# EAGLE design PandN (EAGLE 5.10)
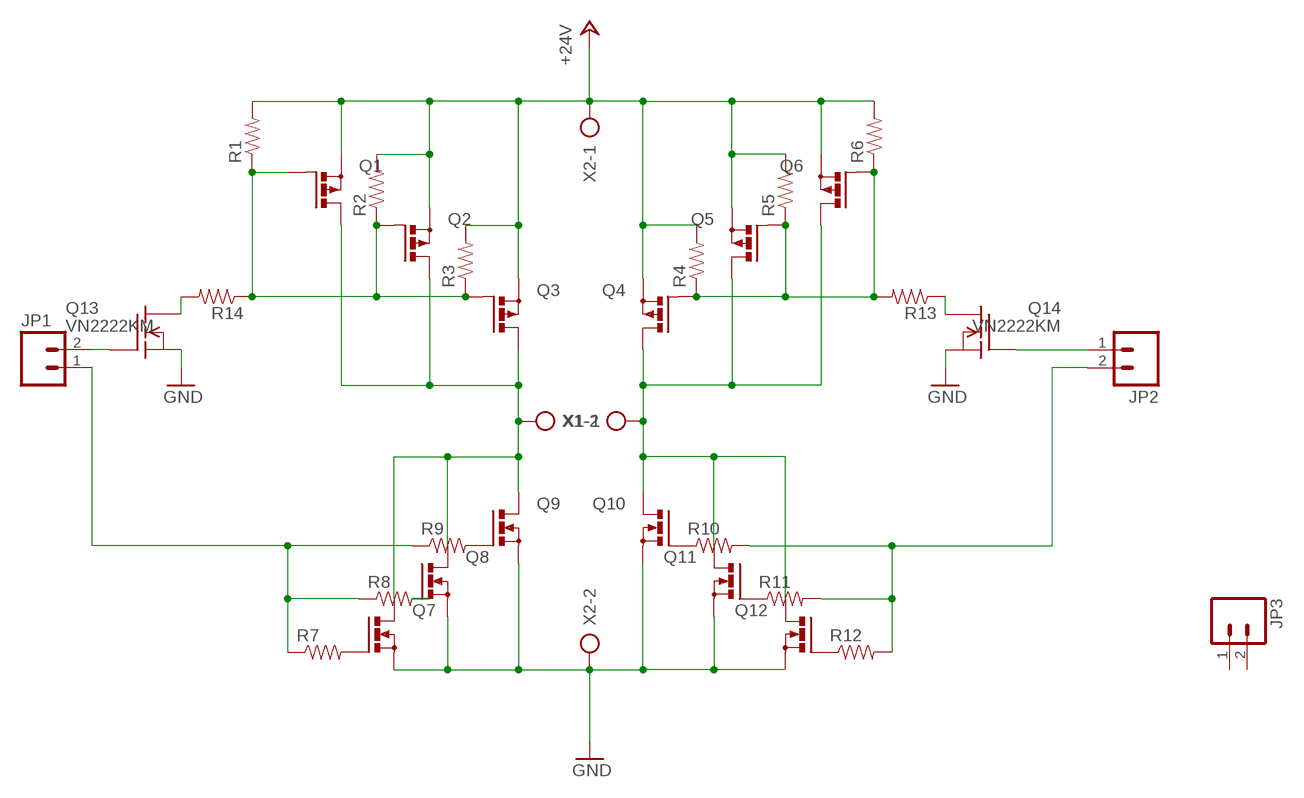
[diagram p0: schematic, sheet 1]

## Parts
JP1  M02PTH  [1X02]
JP2  M02PTH  [1X02]
JP3  M02PTH  [1X02]
Q1  PMOSFET_PTO220BV  [TO220BV]
Q2  PMOSFET_PTO220BV  [TO220BV]
Q3  PMOSFET_PTO220BV  [TO220BV]
Q4  PMOSFET_PTO220BV  [TO220BV]
Q5  PMOSFET_PTO220BV  [TO220BV]
Q6  PMOSFET_PTO220BV  [TO220BV]
Q7  PMOSFET_NTO220BV  [TO220BV]
Q8  PMOSFET_NTO220BV  [TO220BV]
Q9  PMOSFET_NTO220BV  [TO220BV]
Q10  PMOSFET_NTO220BV  [TO220BV]
Q11  PMOSFET_NTO220BV  [TO220BV]
Q12  PMOSFET_NTO220BV  [TO220BV]
Q13  VN2222KM  [TO237]
Q14  VN2222KM  [TO237]
R1  RESISTORPTH-1/6W  [1/6W-RES]
R2  RESISTORPTH-1/6W  [1/6W-RES]
R3  RESISTORPTH-1/6W  [1/6W-RES]
R4  RESISTORPTH-1/6W  [1/6W-RES]
R5  RESISTORPTH-1/6W  [1/6W-RES]
R6  RESISTORPTH-1/6W  [1/6W-RES]
R7  RESISTORPTH-1/6W  [1/6W-RES]
R8  RESISTORPTH-1/6W  [1/6W-RES]
R9  RESISTORPTH-1/6W  [1/6W-RES]
R10  RESISTORPTH-1/6W  [1/6W-RES]
R11  RESISTORPTH-1/6W  [1/6W-RES]
R12  RESISTORPTH-1/6W  [1/6W-RES]
R13  RESISTORPTH-1/6W  [1/6W-RES]
R14  RESISTORPTH-1/6W  [1/6W-RES]
X1  AK500/2  [AK500/2]
X2  AK500/2  [AK500/2]

## Nets
+24V: Q1.S Q2.S Q3.S Q4.S Q5.S Q6.S R1.2 R2.2 R3.2 R4.2 R5.2 R6.2 X2.1
GND: Q7.S Q8.S Q9.S Q10.S Q11.S Q12.S Q13.3(S) Q14.3(S) X2.2
N$1: Q1.D Q2.D Q3.D Q7.D Q8.D Q9.D X1.1
N$2: Q4.D Q5.D Q6.D Q10.D Q11.D Q12.D X1.2
N$3: Q4.G Q5.G Q6.G R4.1 R5.1 R6.1 R13.2
N$4: JP1.2 Q13.2(G)
N$5: JP2.1 Q14.2(G)
N$6: Q1.G Q2.G Q3.G R1.1 R2.1 R3.1 R14.1
N$7: Q11.G R11.1
N$8: Q10.G R10.1
N$9: Q12.G R12.1
N$10: Q7.G R7.2
N$11: Q8.G R8.2
N$12: Q9.G R9.2
N$13: Q13.1(D) R14.2
N$14: Q14.1(D) R13.1
N$22: JP1.1 R7.1 R8.1 R9.1
N$23: JP2.2 R10.2 R11.2 R12.2
Unconnected: JP3.1 JP3.2

## Library data of the parts
JP1-JP3 = SparkFun:M02: Header 2 Standard 2-pin 0.1" header. Use with straight break away headers (SKU : PRT-00116), right angle break away headers (PRT-00553), swiss pins (PRT-00743), machine pins (PRT-00117), and female headers (PRT-00115). Molex polarized connector foot print use with SKU : PRT-08233 with associated crimp pins and housings.
Q1-Q6 = transistor-power:PMOSFET_P: Power MOSFET P-Channel
Q7-Q12 = transistor-power:PMOSFET_N: Power MOSFET N-Channel
Q13 Q14 = transistor-fet:VN2222KM: N-Channel Enhancement MOSFET (VMOS); 60V; 0,5A; 7,5Ohm
R1-R14 = SparkFun:RESISTOR: Resistor Basic schematic elements and footprints for 0603, 1206, and PTH 1/10th watt (small) resistors.
X1 X2 = con-ptr500:AK500/2: CONNECTOR

## Board
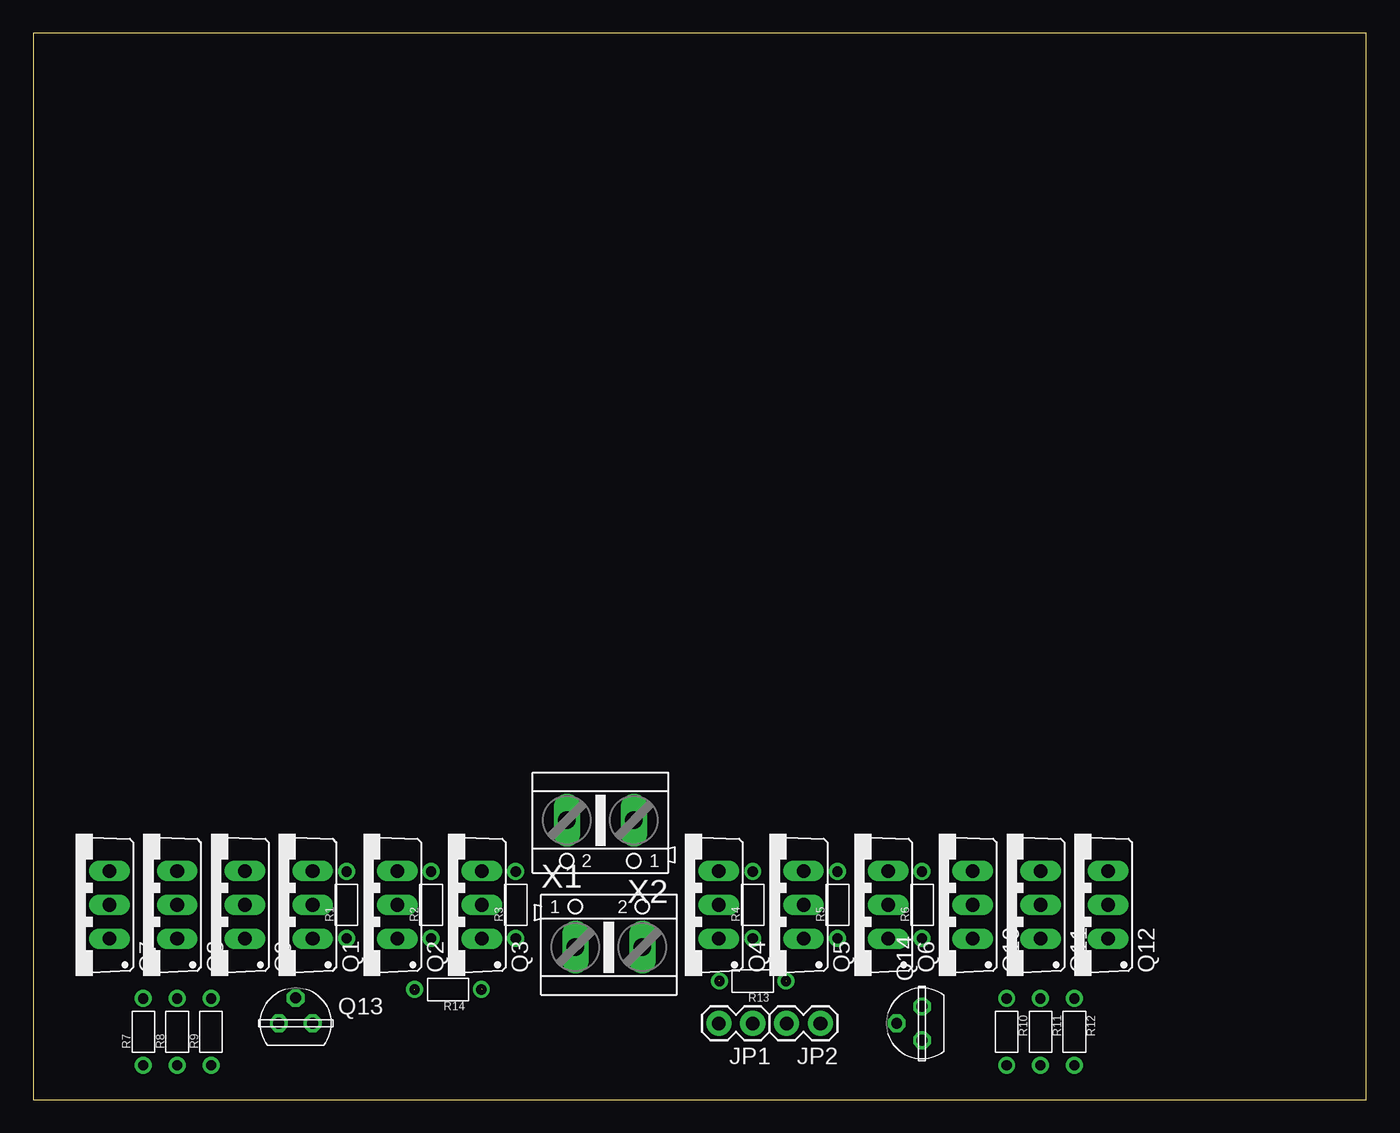
[diagram p1: board, top side]
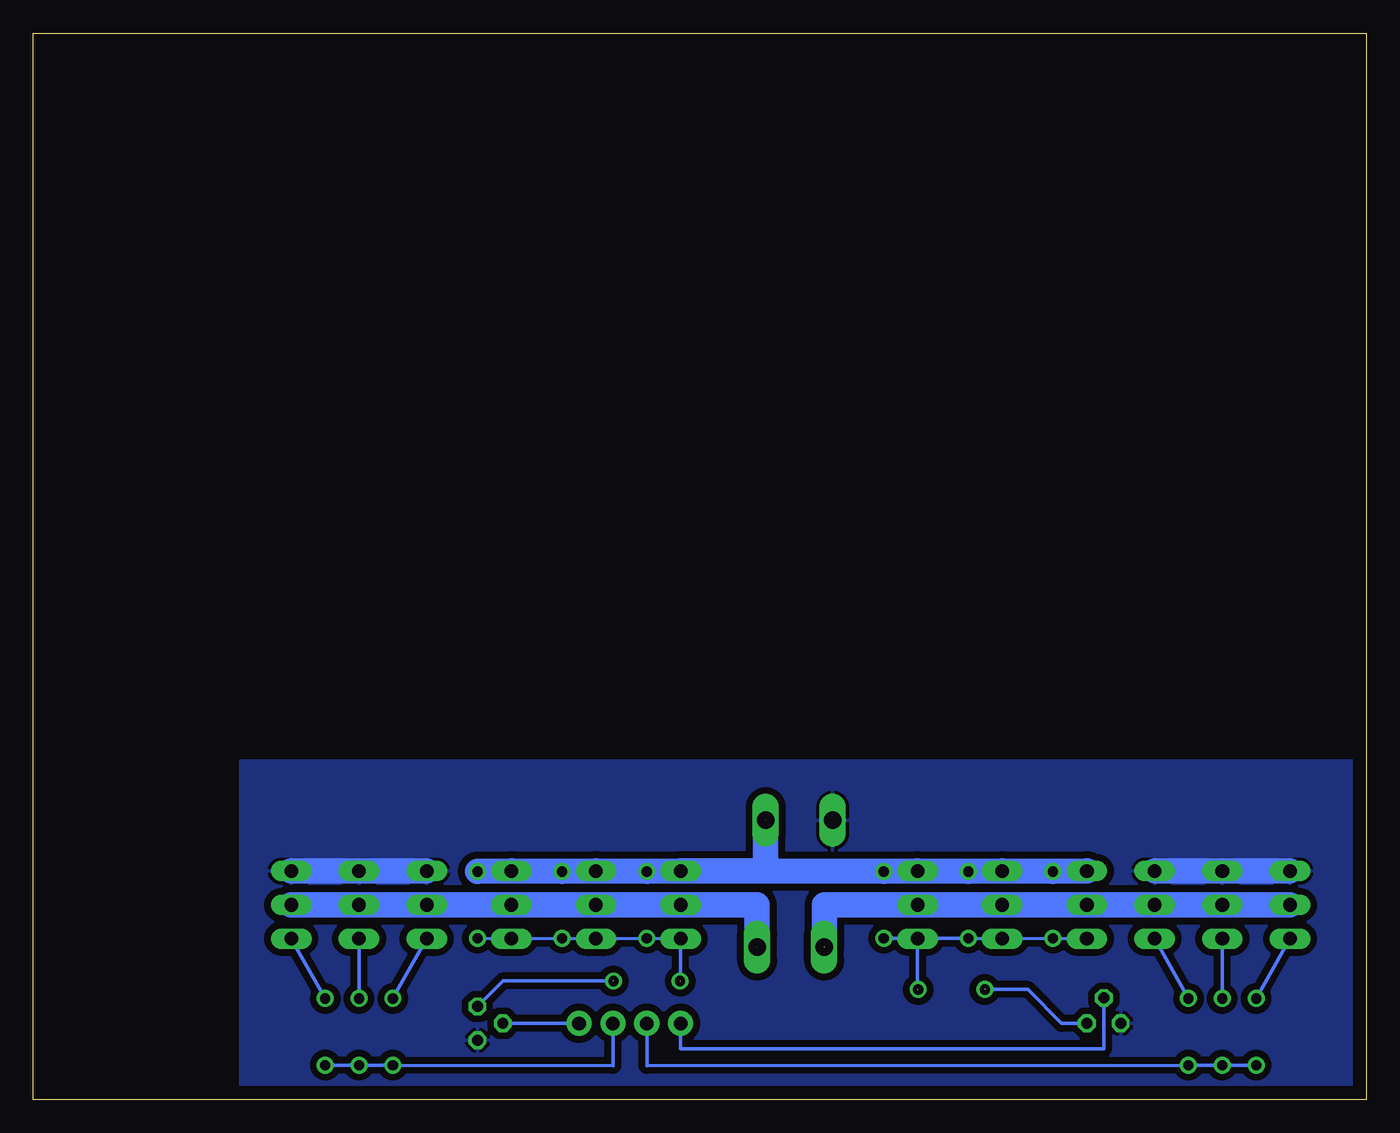
[diagram p2: board, bottom side, seen from below]

Size 100 x 80 mm. Coordinates in mm from the lower left corner, seen from the top.
Outline: 0,0 100,0 100,80 0,80 0,0
Copper layers (1*16): Top 0.035mm / dielectric 1.5mm / Bottom 0.035mm
Design rules "default *": minimum track width 10mil, minimum drill 24mil, track to track 20mil, track to pad 20mil, pad to pad 8mil, via to via 8mil, smd to smd 8mil, copper to edge 40mil, drill to drill 8mil, minimum pad ring 10mil, minimum via ring 8mil, stop-mask expansion 4mil, vias tented up to drill 0mil, thermal gap 10mil

### Footprints (pad centres in the part's own frame; a part is rotated, then mirrored left to right if it is on the bottom)
1X02 = drill 1.016 pad 1.88 round: 1 0,0; 2 2.54,0
TO220BV = drill 1.016 long: D 0,-2.54; G -2.54,-2.54; S 2.54,-2.54
TO237 = drill 0.813 octagon: 1 1.27,0; 2 0,1.905; 3 -1.27,0
1/6W-RES = drill 0.762 round: 1 -2.5,0; 2 2.5,0
AK500/2 = drill 1.321 long: 1 -2.515,0; 2 2.515,0

### Placement (x,y rotation side)
JP1  53.98,5.71 180 top
JP2  59.05,5.71 180 top
JP3  2.54,-16.51 0 top  (outside the outline)
Q1  18.41,14.61 90 top
Q2  24.77,14.61 90 top
Q3  31.11,14.61 90 top
Q4  48.9,14.61 90 top
Q5  55.24,14.61 90 top
Q6  61.59,14.61 90 top
Q7  3.17,14.61 90 top
Q8  8.26,14.61 90 top
Q9  13.34,14.61 90 top
Q10  67.94,14.61 90 top
Q11  73.03,14.61 90 top
Q12  78.11,14.61 90 top
Q13  19.68,5.71 0 top
Q14  66.67,5.71 90 top
R1  23.5,14.61 90 top
R2  29.84,14.61 90 top
R3  36.2,14.61 90 top
R4  53.98,14.61 90 top
R5  60.33,14.61 90 top
R6  66.67,14.61 90 top
R7  8.26,5.08 90 top
R8  10.79,5.08 90 top
R9  13.34,5.08 90 top
R10  73.03,5.08 270 top
R11  75.56,5.08 270 top
R12  78.11,5.08 270 top
R13  53.98,8.89 180 top
R14  31.11,8.26 180 top
X1  43.18,11.43 0 top
X2  42.55,20.95 180 top

### Tracks (layer width: path | path; a pad name or v marks a point on that pad's centre or on a via)
+24V  (1 unrouted)
  Bottom 1.93: Q1.S R1.2 Q2.S R2.2 Q3.S R3.2 45.09,17.14 | R6.2 Q6.S R5.2 Q5.S R4.2 Q4.S 45.09,17.14 | 45.09,17.14 45.09,20.95
GND
  Bottom 1.93: Q7.S Q8.S Q9.S | Q12.S Q11.S Q10.S
  pour Bottom: 0.64,25.4 0.64,0.64 84.45,0.64 84.45,25.4
N$1  (1 unrouted)
  Bottom 1.93: Q7.D Q8.D Q9.D Q1.D Q2.D Q3.D 40.64,14.61 40.64,11.43
N$2  (1 unrouted)
  Bottom 1.93: Q12.D Q11.D Q10.D Q6.D Q5.D Q4.D 45.72,14.61 45.72,11.43
N$3  (1 unrouted)
  Bottom 0.254: R6.1 Q6.G R5.1 Q5.G R4.1 Q4.G 51.44,8.89
N$4
  Bottom 0.254: JP1.2 51.44,3.81 19.68,3.81 Q13.2
N$5
  Bottom 0.254: JP2.1 Q14.2
N$6  (1 unrouted)
  Bottom 0.254: Q1.G R1.1 Q2.G R2.1 R3.1 Q3.G 33.66,8.26
N$7
  Bottom 0.254: R11.1 Q11.G
N$8
  Bottom 0.254: R10.1 Q10.G
N$9
  Bottom 0.254: R12.1 Q12.G
N$10
  Bottom 0.254: R7.2 Q7.G
N$11
  Bottom 0.254: R8.2 Q8.G
N$12
  Bottom 0.254: R9.2 Q9.G
N$13  (1 unrouted)
  Bottom 0.254: Q13.1 22.86,5.71 25.4,8.26 28.57,8.26
N$14  (1 unrouted)
  Bottom 0.254: 56.52,8.89 64.77,8.89 Q14.1
N$22
  Bottom 0.254: R7.1 R8.1 R9.1 53.98,2.54 JP1.1
N$23
  Bottom 0.254: R12.2 R11.2 R10.2 56.52,2.54 JP2.2